# Altium schematic sheet 5 LC SEC.SchDoc: 6.6kW Daul OBC +11kW WPT
size A3; Date: 19/12/16; Revision: V 1.0; SheetNumber: 5; SheetTotal: 14; PageSetup: Record=PageOptions|CenterHorizontal=True|CenterVertical=True|PrintScale=0.71|XCorrection=1.00|YCorrection=1.00|PrintKind=2|BorderSize=5000000|LeftOffset=0|BottomOffset=0|Orientation=2|PaperLength=1000|PaperWidth=1000|Scale=100|PaperSource=7|PrintQuality=-4|MediaType=1|DitherType=10|PaperKind=A4|PrintScaleMode=1; ImagePath: 0
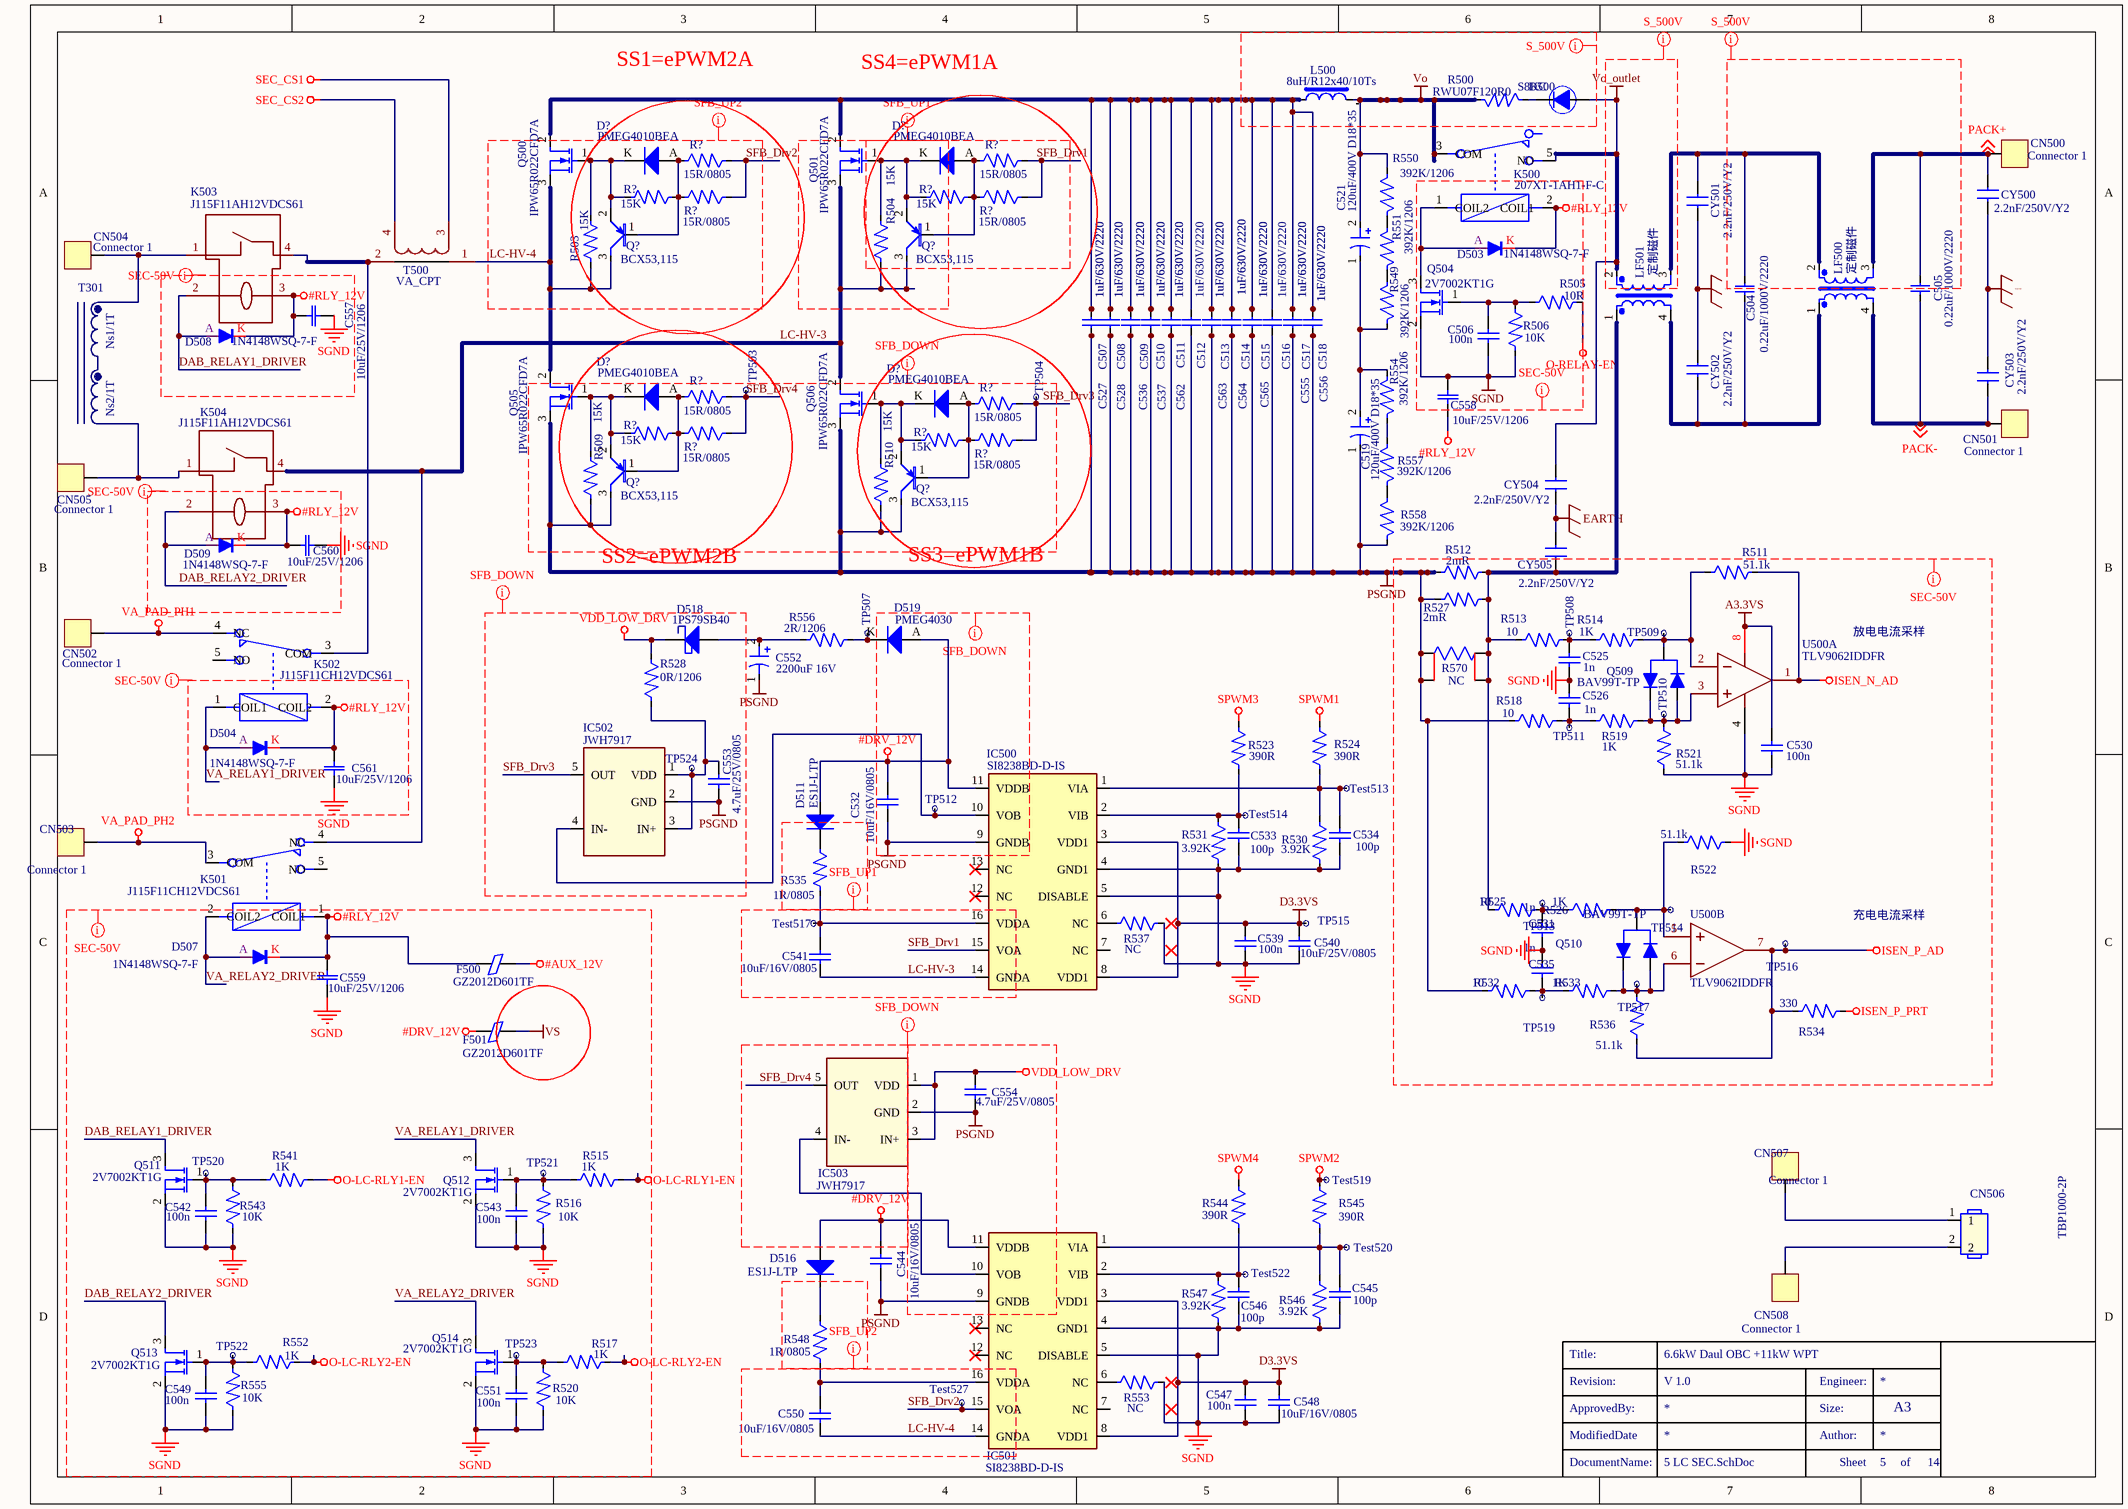
[diagram p0: 5 LC SEC.SchDoc]

## Parts
(Parts that share a designator on the sheet are numbered #1, #2 ... from top to bottom, then left to right.)
C504  0.22uF/1000V/2220  [C2220]
C505  0.22uF/1000V/2220  [C2220]
C506  100n  [C0402]
C507  1uF/630V/2220  [C2220]
C508  1uF/630V/2220  [C2220]
C509  1uF/630V/2220  [C2220]
C510  1uF/630V/2220  [C2220]
C511  1uF/630V/2220  [C2220]
C512  1uF/630V/2220  [C2220]
C513  1uF/630V/2220  [C2220]
C514  1uF/630V/2220  [C2220]
C515  1uF/630V/2220  [C2220]
C516  1uF/630V/2220  [C2220]
C517  1uF/630V/2220  [C2220]
C518  1uF/630V/2220  [C2220]
C519  120uF/400V D18*35  [ECAP_D18_H50_P7.5]
C521  120uF/400V D18*35  [ECAP_D18_H50_P7.5]
C525  1n  [C0402]
C526  1n  [C0402]
C527  1uF/630V/2220  [C2220]
C528  1uF/630V/2220  [C2220]
C530  100n  [C0402]
C531  1n  [C0402]
C532  10uF/16V/0805  [C0805]
C533  100p  [C0402]
C534  100p  [C0402]
C535  1n  [C0402]
C536  1uF/630V/2220  [C2220]
C537  1uF/630V/2220  [C2220]
C539  100n  [C0402]
C540  10uF/25V/0805  [C0805]
C541  10uF/16V/0805  [C0805]
C542  100n  [C0402]
C543  100n  [C0402]
C544  10uF/16V/0805  [C0805]
C545  100p  [C0402]
C546  100p  [C0402]
C547  100n  [C0402]
C548  10uF/16V/0805  [C0805]
C549  100n  [C0402]
C550  10uF/16V/0805  [C0805]
C551  100n  [C0402]
C552  2200uF 16V  [ECAP_D10_H25_P5]
C553  4.7uF/25V/0805  [c0805]
C554  4.7uF/25V/0805  [C0805]
C555  1uF/630V/2220  [C2220]
C556  1uF/630V/2220  [C2220]
C557  10uF/25V/1206  [C1206]
C558  10uF/25V/1206  [C1206]
C559  10uF/25V/1206  [C1206]
C560  10uF/25V/1206  [C1206]
C561  10uF/25V/1206  [C1206]
C562  1uF/630V/2220  [C2220]
C563  1uF/630V/2220  [C2220]
C564  1uF/630V/2220  [C2220]
C565  1uF/630V/2220  [C2220]
CN500  Connector 1  [CN-M4-45A]
CN501  Connector 1  [CN-M4-45A]
CN502  Connector 1  [CN-M4-45A]
CN503  Connector 1  [CN-M4-45A]
CN504  Connector 1  [CON_4]
CN505  Connector 1  [CON_4]
CN506  TBP1000-2P  [CON_TB1000_00_2P]
CN507  Connector 1  [Wire_2.5_Hook]
CN508  Connector 1  [Wire_2.5_Hook]
CY500  2.2nF/250V/Y2  [C_DISK_8_0S]
CY501  2.2nF/250V/Y2  [C_DISK_8_0S]
CY502  2.2nF/250V/Y2  [C_DISK_8_0S]
CY503  2.2nF/250V/Y2  [C_DISK_8_0S]
CY504  2.2nF/250V/Y2  [C_DISK_8_0S]
CY505  2.2nF/250V/Y2  [C_DISK_8_0S]
D500  S8KC  [D_SMC]
D503  1N4148WSQ-7-F  [D_SOD323]
D504  1N4148WSQ-7-F  [D_SOD323]
D507  1N4148WSQ-7-F  [D_SOD323]
D508  1N4148WSQ-7-F  [D_SOD323]
D509  1N4148WSQ-7-F  [D_SOD323]
D511  ES1J-LTP  [DO-214AC]
D516  ES1J-LTP  [DO-214AC]
D518  1PS79SB40  [D_SOD-523_SC-79]
D519  PMEG4030  [D_SOD123]
D?#1  PMEG4010BEA  [D_SOD323]
D?#2  PMEG4010BEA  [D_SOD323]
D?#3  PMEG4010BEA  [D_SOD323]
D?#4  PMEG4010BEA  [D_SOD323]
F500  GZ2012D601TF  [R0805]
F501  GZ2012D601TF  [R0805]
IC500  SI8238BD‐D‐IS  [SOIC_W_16]
IC501  SI8238BD‐D‐IS  [SOIC_W_16]
IC502  JWH7917  [SOT23-5]
IC503  JWH7917  [SOT-23_5]
K500  207XT-1AH1-F-C  [RELAY_110E]
K501  J115F11CH12VDCS61  [J115F11C]
K502  J115F11CH12VDCS61  [J115F11C]
K503  J115F11AH12VDCS61  [J115F11A]
K504  J115F11AH12VDCS61  [J115F11A]
L500  8uH/R12x40/10Ts  [R10*35.5]
LF500  定制磁件  [L_31*19*15_C]
LF501  定制磁件  [L_31*19*15_C]
Q500  IPW65R022CFD7A  [Q_TO-247_TH _1]
Q501  IPW65R022CFD7A  [Q_TO-247_TH _1]
Q504  2V7002KT1G  [Q_SOT23 - 2]
Q505  IPW65R022CFD7A  [Q_TO-247_TH _1]
Q506  IPW65R022CFD7A  [Q_TO-247_TH _1]
Q509  BAV99T-TP  [D_SOT-523]
Q510  BAV99T-TP  [D_SOT-523]
Q511  2V7002KT1G  [Q_SOT23 - 2]
Q512  2V7002KT1G  [Q_SOT23 - 2]
Q513  2V7002KT1G  [Q_SOT23 - 2]
Q514  2V7002KT1G  [Q_SOT23 - 2]
Q?#1  BCX53,115  [SOT89_MCP1703]
Q?#2  BCX53,115  [SOT89_MCP1703]
Q?#3  BCX53,115  [SOT89_MCP1703]
Q?#4  BCX53,115  [SOT89_MCP1703]
R500  RWU07F120R0  [R7W-N]
R503  15K  [R0402]
R504  15K  [R0402]
R505  10R  [R0402]
R506  10K  [R0402]
R509  15K  [R0402]
R510  15K  [R0402]
R511  51.1k  [R0402]
R512  2mR  [r2512]
R513  10  [R0402]
R514  1K  [R0402]
R515  1K  [R0402]
R516  10K  [R0402]
R517  1K  [R0402]
R518  10  [R0402]
R519  1K  [R0402]
R520  10K  [R0402]
R521  51.1k  [R0402]
R522  51.1k  [R0402]
R523  390R  [R0402]
R524  390R  [R0402]
R525  10  [R0402]
R526  1K  [R0402]
R527  2mR  [r2512]
R528  0R/1206  [R1206]
R530  3.92K  [R0402]
R531  3.92K  [R0402]
R532  10  [R0402]
R533  1K  [R0402]
R534  330  [R0402]
R535  1R/0805  [R0805]
R536  51.1k  [R0402]
R537  NC  [R0402]
R541  1K  [R0402]
R543  10K  [R0402]
R544  390R  [R0402]
R545  390R  [R0402]
R546  3.92K  [R0402]
R547  3.92K  [R0402]
R548  1R/0805  [R0805]
R549  392K/1206  [R1206]
R550  392K/1206  [R1206]
R551  392K/1206  [R1206]
R552  1K  [R0402]
R553  NC  [R0402]
R554  392K/1206  [R1206]
R555  10K  [R0402]
R556  2R/1206  [R1206]
R557  392K/1206  [R1206]
R558  392K/1206  [R1206]
R570  NC  [WSL3637]
R?#1  15R/0805  [R0805]
R?#2  15R/0805  [R0805]
R?#3  15K  [R0402]
R?#4  15R/0805  [R0805]
R?#5  15K  [R0402]
R?#6  15R/0805  [R0805]
R?#7  15R/0805  [R0805]
R?#8  15R/0805  [R0805]
R?#9  15K  [R0402]
R?#10  15R/0805  [R0805]
R?#11  15K  [R0402]
R?#12  15R/0805  [R0805]
T500  VA_CPT  [CS_15_7_13]
Test513  测试点  [测试点]  (value not drawn)
Test514  测试点  [测试点]  (value not drawn)
Test517  测试点  [测试点]  (value not drawn)
Test519  测试点  [测试点]  (value not drawn)
Test520  测试点  [测试点]  (value not drawn)
Test522  测试点  [测试点]  (value not drawn)
Test527  测试点  [测试点]  (value not drawn)
TP503  测试点  [测试点]  (value not drawn)
TP504  测试点  [测试点]  (value not drawn)
TP507  测试点  [测试点]  (value not drawn)
TP508  测试点  [测试点]  (value not drawn)
TP509  测试点  [测试点]  (value not drawn)
TP510  测试点  [测试点]  (value not drawn)
TP511  测试点  [测试点]  (value not drawn)
TP512  测试点  [测试点]  (value not drawn)
TP513  测试点  [测试点]  (value not drawn)
TP514  测试点  [测试点]  (value not drawn)
TP515  测试点  [测试点]  (value not drawn)
TP516  测试点  [测试点]  (value not drawn)
TP517  测试点  [测试点]  (value not drawn)
TP519  测试点  [测试点]  (value not drawn)
TP520  测试点  [测试点]  (value not drawn)
TP521  测试点  [测试点]  (value not drawn)
TP522  测试点  [测试点]  (value not drawn)
TP523  测试点  [测试点]  (value not drawn)
TP524  测试点  [测试点]  (value not drawn)
U500  TLV9062IDDFR  [TSOT-23-8_L2.9-W1.6-P0.65-LS2.8-BL]  (parts A,B of 2)

## Nets
#AUX_12V: F500.2
#DRV_12V: C532.2 C544.1 D511.A D516.A D519.A F501.1 IC500.11(VDDB) IC501.11(VDDB)
#RLY_12V: C557.2 C558.1 C559.1 C560.1 C561.1 D503.K D504.K D507.K D508.K D509.K F500.1 K500.2(COIL1) K501.1(COIL1) K502.2(COIL2) K503.3 K504.3
A3.3VS: C530.2 U500.8(V+)
D3.3VS: C539.2 C540.1 C547.2 C548.1 IC500.3(VDD1) IC500.8(VDD1) IC501.3(VDD1) IC501.8(VDD1) TP515.1
EARTH: CY500.2 CY501.1 CY502.1 CY503.2 CY504.1 CY505.1
ISEN_N_AD: R511.2 U500.1(OUT1)
ISEN_P_AD: R534.1 R536.1 TP516.1 U500.7(OUT2)
ISEN_P_PRT: R534.2
O-LC-RLY1-EN: R515.2 R541.2
O-LC-RLY2-EN: R517.2 R552.2
O-RELAY-EN: R505.2
PSGND: C507.1 C508.1 C509.1 C510.1 C511.1 C512.1 C513.1 C514.1 C515.1 C516.1 C517.1 C518.1 C519.1 C527.1 C528.1 C532.1 C536.1 C537.1 C544.2 C552.1 C553.1 C554.1 C555.1 C556.1 C562.1 C563.1 C564.1 C565.1 IC500.9(GNDB) IC501.9(GNDB) IC502.2(GND) IC503.2(GND) Q505.3(S) Q506.3(S) Q?#3.3(C) Q?#4.3(C) R509.1 R510.1 R512.1 R518.1 R527.1 R532.1 R558.2 R570.L1 R570.L3
SEC_CS1: T500.3
SEC_CS2: T500.4
SGND: C506.2 C525.1 C526.2 C530.1 C531.1 C533.1 C534.1 C535.2 C539.1 C540.2 C542.2 C543.2 C545.1 C546.1 C547.1 C548.2 C549.2 C551.2 C557.1 C558.2 C559.2 C560.2 C561.2 IC500.4(GND1) IC500.5(DISABLE) IC501.4(GND1) IC501.5(DISABLE) Q504.2(S) Q511.2(S) Q512.2(S) Q513.2(S) Q514.2(S) R506.2 R516.2 R520.2 R521.1 R522.2 R530.2 R531.2 R537.2 R543.2 R546.2 R547.2 R553.2 R555.2 U500.4(V-)
SPWM1: R524.1
SPWM2: R545.1 Test519.1
SPWM3: R523.1
SPWM4: R544.1
VA_PAD_PH1: CN502.1 K502.4(NC)
VA_PAD_PH2: CN503.1 K501.3(COM)
VDD_LOW_DRV: C554.2 D518.K IC503.1(VDD) IC503.3(IN+) R528.2
Vo: C521.2 K500.3(COM) L500.2 R500.2 R550.1
Vo_outlet: CY504.2 D500.A K500.5(NO) LF501.2
VS: F501.2
DAB_RELAY1_DRIVER: D508.A K503.2 Q511.3(D)
DAB_RELAY2_DRIVER: D509.A K504.2 Q513.3(D)
LC-HV-3: C541.1 IC500.14(GNDA) K501.4(NC) K504.4 Q501.3(S) Q506.2(D) Q?#2.3(C) R504.1
LC-HV-4: C550.2 IC501.14(GNDA) Q500.3(S) Q505.2(D) Q?#1.3(C) R503.1 T500.1
PACK+: C505.2 CN500.1 CY500.1 LF500.3 ; off-sheet PACK+
PACK-: C505.1 CN501.1 CY503.1 LF500.4 ; off-sheet PACK-
SFB_Drv1: IC500.15(VOA) R?#2.1 R?#6.1
SFB_Drv2: IC501.15(VOA) R?#1.1 R?#4.1 Test527.1
SFB_Drv3: IC502.5(OUT) R?#8.1 R?#12.1 TP504.1
SFB_Drv4: IC503.5(OUT) R?#7.1 R?#10.1 TP503.1
VA_RELAY1_DRIVER: D504.A K502.1(COIL1) Q512.3(D)
VA_RELAY2_DRIVER: D507.A K501.2(COIL2) Q514.3(D)
NetC504_1: C504.1 CY502.2 LF500.1 LF501.4
NetC504_2: C504.2 CY501.2 LF500.2 LF501.3
NetC506_1: C506.1 Q504.1(G) R505.1 R506.1
NetC507_2: C507.2 C508.2 C509.2 C510.2 C511.2 C512.2 C513.2 C514.2 C515.2 C516.2 C517.2 C518.2 C527.2 C528.2 C536.2 C537.2 C555.2 C556.2 C562.2 C563.2 C564.2 C565.2 L500.1 Q500.2(D) Q501.2(D)
NetC519_2: C519.2 C521.1 R549.2 R554.1
NetC525_2: C525.2 R513.2 R514.1 TP508.1
NetC526_1: C526.1 R518.2 R519.1 TP511.1
NetC531_2: C531.2 R525.2 R526.1 TP513.1
NetC533_2: C533.2 IC500.2(VIB) R523.2 R531.1 Test514.1
NetC534_2: C534.2 IC500.1(VIA) R524.2 R530.1 Test513.1
NetC535_1: C535.1 R532.2 R533.1 TP519.1
NetC541_2: C541.2 IC500.16(VDDA) R535.2 Test517.1
NetC542_1: C542.1 Q511.1(G) R541.1 R543.1 TP520.1
NetC543_1: C543.1 Q512.1(G) R515.1 R516.1 TP521.1
NetC545_2: C545.2 IC501.1(VIA) R545.2 R546.1 Test520.1
NetC546_2: C546.2 IC501.2(VIB) R544.2 R547.1 Test522.1
NetC549_1: C549.1 Q513.1(G) R552.1 R555.1 TP522.1
NetC550_1: C550.1 IC501.16(VDDA) R548.2
NetC551_1: C551.1 Q514.1(G) R517.1 R520.1 TP523.1
NetC552_2: C552.2 D518.A R556.1
NetC553_2: C553.2 IC502.1(VDD) IC502.3(IN+) R528.1 TP524.1
NetCN504_1: CN504.1 K503.1
NetCN505_1: CN505.1 K504.1
NetCN506_1: CN506.1 CN507.1
NetCN506_2: CN506.2 CN508.1
NetCY505_2: CY505.2 LF501.1 R512.2 R513.1 R525.1 R527.2 R570.L2 R570.L4
NetD500_K: D500.K R500.1
NetD503_A: D503.A K500.1(COIL2) Q504.3(D)
NetD511_K: D511.K R535.1
NetD516_K: D516.K R548.1
NetD519_K: D519.K R556.2 TP507.1
NetD?#1_A: D?#1.A Q?#1.1(B) R?#1.2 R?#3.2 R?#4.2
NetD?#1_K: D?#1.K Q500.1(G) Q?#1.2(E) R503.2 R?#3.1
NetD?#2_A: D?#2.A Q?#2.1(B) R?#2.2 R?#5.2 R?#6.2
NetD?#2_K: D?#2.K Q501.1(G) Q?#2.2(E) R504.2 R?#5.1
NetD?#3_A: D?#3.A Q?#3.1(B) R?#7.2 R?#9.2 R?#10.2
NetD?#3_K: D?#3.K Q505.1(G) Q?#3.2(E) R509.2 R?#9.1
NetD?#4_A: D?#4.A Q?#4.1(B) R?#8.2 R?#11.2 R?#12.2
NetD?#4_K: D?#4.K Q506.1(G) Q?#4.2(E) R510.2 R?#11.1
NetIC500_6: IC500.6(NC) R537.1
NetIC500_10: IC500.10(VOB) IC502.4(IN-) TP512.1
NetIC501_6: IC501.6(NC) R553.1
NetIC501_10: IC501.10(VOB) IC503.4(IN-)
NetK502_3: K502.3(COM) K503.4 T500.2
NetQ509_1: Q509.1(A) Q509.2(K) R519.2 R521.2 TP510.1 U500.3(IN1+)
NetQ509_3: Q509.3(COMMMON) R511.1 R514.2 TP509.1 U500.2(IN1-)
NetQ510_1: Q510.1(A) Q510.2(K) R533.2 R536.2 TP517.1 U500.6(IN2-)
NetQ510_3: Q510.3(COMMMON) R522.1 R526.2 TP514.1 U500.5(IN2+)
NetR549_1: R549.1 R551.2
NetR550_2: R550.2 R551.1
NetR554_2: R554.2 R557.1
NetR557_2: R557.2 R558.1

Not connected (* = marked no-connect by the designer): IC500 7(NC) 12(NC)* 13(NC)*; IC501 7(NC) 12(NC)* 13(NC)*; K501 5(NO); K502 5(NO); L500 3

## Layout directives
net class SFB_UP1: LC-HV-3, SFB_Drv1
net class SFB_UP2: LC-HV-4, SFB_Drv2
net class SFB_DOWN: #DRV_12V, PSGND, SFB_Drv3, SFB_Drv4, VDD_LOW_DRV
net class SEC-50V: #AUX_12V, #DRV_12V, #RLY_12V, A3.3VS, DAB_RELAY1_DRIVER, DAB_RELAY2_DRIVER, ISEN_N_AD, ISEN_P_AD, ISEN_P_PRT, O-LC-RLY1-EN, O-LC-RLY2-EN, O-RELAY-EN, SGND, VA_RELAY1_DRIVER, VA_RELAY2_DRIVER, VS
net class S_500V: (no net found under the mark), Vo, Vo_outlet

## Notes on the sheet
- SS1=ePWM2A
- SS4=ePWM1A
- (near CN504) T301
- Ns1/1T
- Ns2/1T
- SS2=ePWM2B
- SS3=ePWM1B
- 放电电流采样
- 充电电流采样
- Revision:
- Title:
- Engineer:
- ModifiedDate
- ApprovedBy:
- Author:
- Size:
- A3
- DocumentName:
- Sheet
- of

## Library data of the parts
C504 C505 C507-C518 C527 C528 C536 C537 C555 C556 C562-C565 = 100033967: CBB21_105/630V; DIP/SMD: DIP; Top/Bottom: Top; Part Number: *
C506 C542 C543 C549 C551 = Cap: Manufacturer: Yageo; Manufacturer P/N: AC0402KRX7R9BB104; DIP/SMD: SMD
C519 C521 C552 = CAPACITOR_EC_D16: EC Capacitor
  C519 C521: Parameter: 120uF/400V D18*35
  C552: Parameter: 2200uF 16V
C525 C526 C530 C531 C533-C535 C539 C540 C544-C548 C550 = CAP
C532 C541 C553 C554 = Cap: Capacitor; Published: 8-Jun-2000; LatestRevisionDate: 17-Jul-2002; LatestRevisionNote: Re-released for DXP Platform.; PackageReference: RAD-0.3; Publisher: Altium Limited; PackageDescription: Radial Cap, Thru-Hole; 2 Leads; 0.3 in Pin Spacing
C557-C561 = CAP0603: Manufacturer: {Manufacturer}; Manufacturer P/N: {Manufacturer P/N}; DIP/SMD: SMD; Top/Bottom: Top; Package: {Package}; Part Number: *
CN500-CN505 CN507 CN508 = Connector 1: Header, 1-Pin; Revision: 17-Jul-2002: Re-released for DXP Platform.; Publisher: Altium Limited
CN506 = CN1.25-02P: 公头 立式 2Pin 2.5mm THT; DIP/SMD: DIP; Top/Bottom: Top; Part Number: *; ZT-80W: ZT-80W
CY500-CY505 = Y-CAP: 2.2nF 20% Y2 250V Φ8 7.5mm muRata; Part Number: DE2E3KY222MA3BM02F; OriginalName: CAPSEMI; ComponentField6: Published 8-Jun-2000; DIP/SMD: DIP; Top/Bottom: Top
D500 = DIODE_HIGH CURRENT_SMD: 800V 8A SMC LITEON; DIP/SMD: SMD; Top/Bottom: Top; Part Number: *
D503 D504 D507-D509 = DIODE,1N4148WSQ-7-F,75V,150mA, SOD-323: 料号: 90-E00D0001; 品名: DIODE 75V 150mA SOD323,DIODES#1N4148WSQ-7-F; 规格: 1N4148WSQ-7-F(DIODES); 厂商: DIODES; Qualified: AEC-Q101; 耐压值: 75V; 温度范围: -65℃~﹢150℃; 重量: 0.006g; BCS料号: *; 值: 1N4148WSQ-7-F
D511 D516 = DIODE
D518 = Schottky  Diode: Schottky Diode
D519 = DIODE_BAT54J: 75V 250mA SOD-523 MCC; DIP/SMD: SMD; Top/Bottom: Bottom; Part Number: *
D?#1-D?#4 = DIODE_BAT54J: 30V 200mA SOD523 NXP; DIP/SMD: SMD; Top/Bottom: Top
F500 F501 = Ferrite Bead 220±25％Ω@100MHz 2.2A 0.05Ω F0603_0.95 BLM18KG221SH1D(Murata): 厂商: MURATA; 品名: Ferrite Bead 220±25％Ω@100MHz 2.2A 0.05Ω F0603_0.95, Murata#BLM18KG221SH1D; 料号: 90-E03L0006; Qualified: AEC-Q200; 温度范围: -55℃~﹢125℃; 重量: 0.005g; 值: 600Ω; 规格: BLM18KG221SH1D(Murata); BCS料号: *; 耐压值: *
IC500 IC501 = ADuM4223/ADuM3223
K500 = RELAYSPDT/16A: 12V 一组常开触点 4Pin hongfra; DIP/SMD: DIP; Top/Bottom: Top; Part Number: *
K501 K502 = RELAY_1C
K503 K504 = J115F11AH12VDCS61: BOM_Manufacturer: null; Contributor: LCSC; BOM_Supplier: LCSC; BOM_Manufacturer Part: J115F11AH12VDCS61; BOM_JLCPCB Part Class: Extended Part; spicePre: U; spiceSymbolName: HF165F-50/12-HT
L500 = INDUCTOR_ROD TYPE: Inductor rod type; Revision: 1; Parameter: 8uH/R12x40/10Ts
LF500 LF501 = LINE FILTER_RING CORE: DIP/SMD: DIP
Q500 Q501 Q505 Q506 = MOSFET_N CHANNEL: N MOS FET; Parameter: 2N7002K-T1GE3
Q504 Q511-Q514 = MOSFET_N CHANNEL: Manufacturer: ONSemi; DIP/SMD: SMD; Manufacturer P/N: 2V7002KT1G
Q509 Q510 = DIODE_BAV99: 85V 75mA SOT-523 MCC; DIP/SMD: SMD; Top/Bottom: Top; Part Number: *
Q?#1-Q?#4 = PNP
R500 = RESISTOR_1206: RESISTOR; DIP/SMD: DIP; Top/Bottom: Top; Part Number: *
R503 R504 R509-R511 R513 R514 R518 R519 R521-R526 R528 R530-R537 R544-R548 R553 R556 R?#3 R?#5 R?#9 R?#11 = RESISTOR
R505 R515 R517 R541 R552 = RESISTOR_1206: Manufacturer: Yageo; Manufacturer P/N: AC0402FR-0710RL; DIP/SMD: SMD
R506 R516 R520 R543 R555 = RESISTOR_1206: Manufacturer: Yageo; Manufacturer P/N: AC0402FR-0710KL; DIP/SMD: SMD
R512 R527 = RESISTOR_2010: RESISTOR; Parameter: 1mR
R549-R551 R554 R557 R558 R?#1 R?#2 R?#4 R?#6-R?#8 R?#10 R?#12 = RESISTOR_0805: RESISTOR; DIP/SMD: SMD; Top/Bottom: Top; Part Number: *
  R?#1 R?#2 R?#4 R?#6-R?#8 R?#10 R?#12: VALUE: 15R/0805
R570 = RES4pin: RES1206; Manufacturer P/N: {Manufacturer P/N}; Manufacturer: {Manufacturer}; OriginalName: RES1; ComponentField6: Published 8-Jun-2000; DIP/SMD: SMD; Top/Bottom: Top; Package: {Package}; Part Number: *; ZT-80W: ZT-80W; Value: NC
T500 = VA_CPT: Contributor: hyydy; spicePre: T; spiceSymbolName: 电流互感器 30A 1：300
U500 = TLV9062IDDFR: BOM_Manufacturer: TI(德州仪器); subpart_no: 1; BOM_Supplier: LCSC; BOM_Supplier Part: C2867884; BOM_Manufacturer Part: TLV9062IDDFR; link: https://atta.szlcsc.comnull; BOM_JLCPCB Part Class: Extended Part; spicePre: U; spiceSymbolName: TLV9062IDDFR